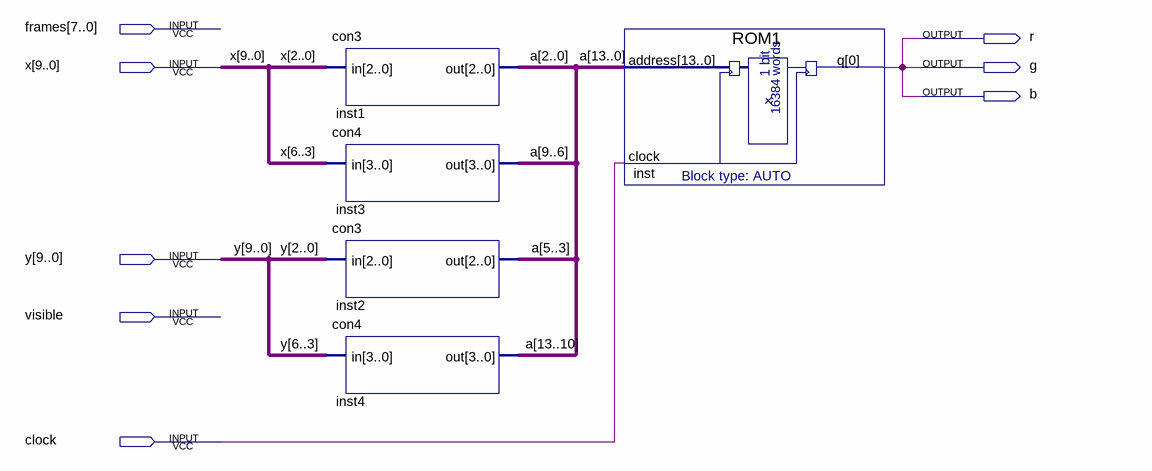
[diagram p0: schematic sheet]
// Quartus schematic code_table.bdf as structural Verilog: 5 symbols, 8 pins
module code_table (
  input  [7:0] frames,
  input  [9:0] x,
  input  [9:0] y,
  input  visible,
  input  clock,
  output r,
  output g,
  output b
);

  wire [13:0] a;

  con3 inst1 (.in(x[2:0]), .out(a[2:0]));
  con4 inst3 (.in(x[6:3]), .out(a[9:6]));
  con3 inst2 (.in(y[2:0]), .out(a[5:3]));
  con4 inst4 (.in(y[6:3]), .out(a[13:10]));
  ROM1 inst (.address(a), .clock(clock), .q(b));

  assign g = b;
  assign r = b;
endmodule
